# Altium schematic sheet H-Bridge.SchDoc: Motor Control
size A3; DrawnBy: Dan Greenhalgh; Address1: ECE Department; Address2: University of Canterbury; Address3: Christchurch 8041; Address4: New Zealand; Revision: 1; SheetNumber: 3; SheetTotal: 4
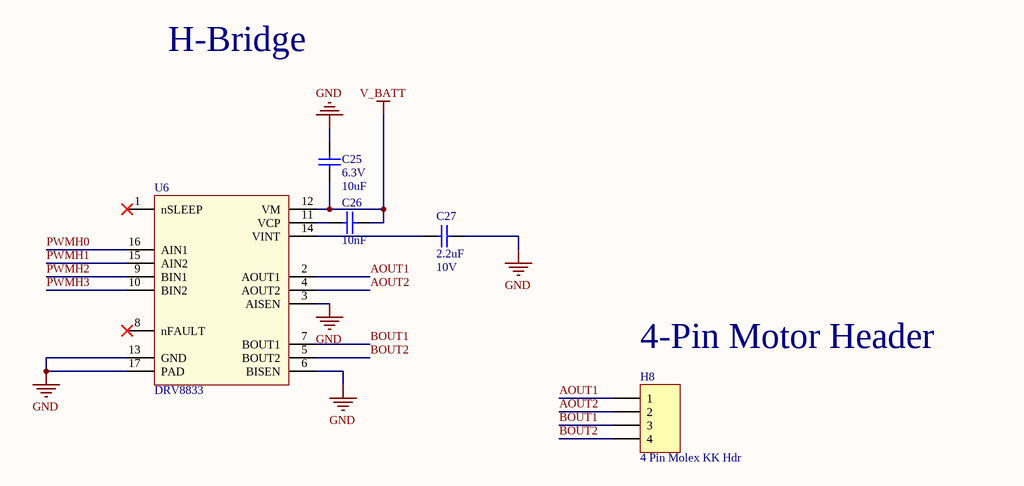
[diagram p0: H-Bridge.SchDoc]

## Parts
C25  Voltage - Rated: 6.3V  [CAPC1608L]  (hidden comment: 10uF)
C26  10nF  [CAPC1608L]
C27  Max Voltage: 10V  [CAPC1608L]  (hidden comment: 2.2uF)
H8  4 Pin Molex KK Hdr  [MOLEX_KK_4_HDR]
U6  DRV8833  [HTSOP16]

## Nets
GND: C25.2 C27.2 U6.3(AISEN) U6.6(BISEN) U6.13(GND) U6.17(PAD)
V_BATT: C25.1 C26.2 U6.12(VM)
AOUT1: H8.1 U6.2(AOUT1)
AOUT2: H8.2 U6.4(AOUT2)
BOUT1: H8.3 U6.7(BOUT1)
BOUT2: H8.4 U6.5(BOUT2)
PWMH0: U6.16(AIN1)
PWMH1: U6.15(AIN2)
PWMH2: U6.9(BIN1)
PWMH3: U6.10(BIN2)
NetC26_1: C26.1 U6.11(VCP)
NetC27_1: C27.1 U6.14(VINT)

Not connected (* = marked no-connect by the designer): U6 1(nSLEEP)* 8(nFAULT)*

## Notes on the sheet
- H-Bridge
- (near H8) 4-Pin Motor Header
- Title
- Drawn by:
- Date:
- Time:
- Revision:
- Sheet
- of
- File:

## Library data of the parts
C25 = CC_10uF_0603: CAP CER 10UF X5R +-20% 6V3 0603; Supplier: ECE Dept; Storage Location: PCB Assembly WS; Value: 10uF
C26 = CC_10nF_0603: CAP CER 10nF X7R +-10% 50V 0603; PackageReference: 0603; Code_IPC: 1608 [0603]; Verify: *; Supplier: ECE Dept; Storage Location: PCB Assembly WS; Value: 10nF
C27 = CC_2.2uF_0603: CAP CER 2.2uF X5R +-20% 10V 0603; PackageReference: 0603; Code_IPC: 1608 [0603]; Verify: *; Supplier: ECE Dept; Storage Location: PCB Assembly WS; Value: 2.2uF
H8 = JA_MOLEX_KK_4POS: CONN HEADER 4POS 2.54mm VERT_Thru Hole; Manufacturer: Molex; Manufacturer PN: 22-23-2041; Supplier Part Number 1: 9731164; Supplier: ECE Dept; Supplier 1: Farnell; Storage Location: ECE Dept Store; Value: 4 Pin Molex KK Hdr
U6 = DRV8833: Dual H-Bridge Motor Driver 1.5A